# EAGLE design ThingPlus_Micromod (EAGLE 9.6.2)
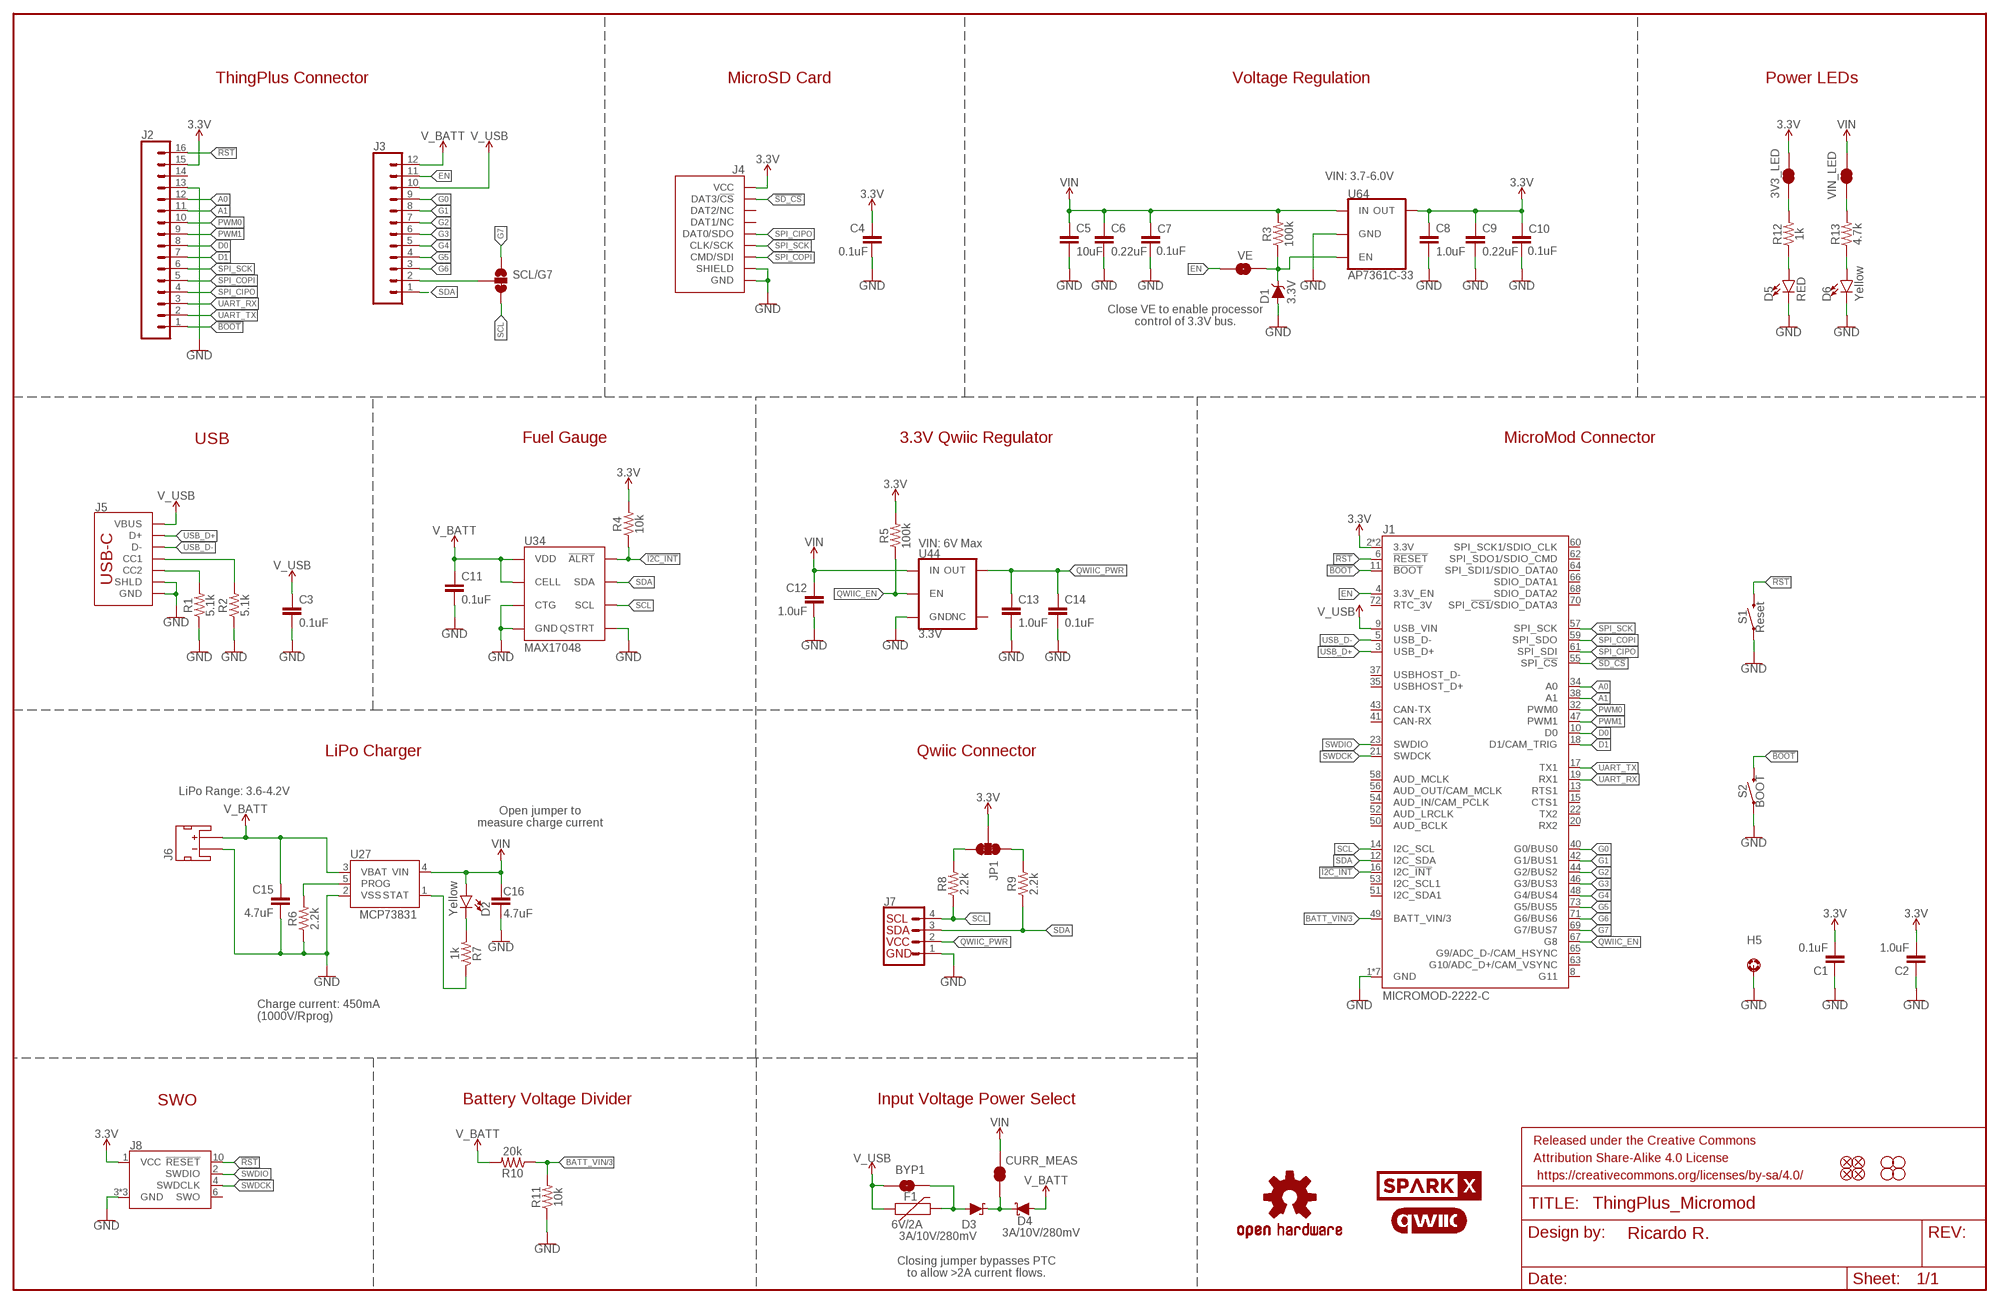
[diagram p0: schematic, sheet 1]

## Parts
3V3_LED  JUMPER-SMT_2_NC_TRACE_SILK  [SMT-JUMPER_2_NC_TRACE_SILK]
BYP1  JUMPER-SMT_2_NO_SILK  [SMT-JUMPER_2_NO_SILK]
C1  0.1uF  0.1UF-0603-25V-(+80/-20%)  [0603]
C2  1.0uF  1.0UF-0603-16V-10%  [0603]
C3  0.1uF  0.1UF-0603-25V-(+80/-20%)  [0603]
C4  0.1uF  0.1UF-0603-25V-(+80/-20%)  [0603]
C5  10uF  10UF-0805-25V-10%  [0805]
C6  0.22uF  0.22UF-0603-25V-10%  [0603]
C7  0.1uF  0.1UF-0603-25V-(+80/-20%)  [0603]
C8  1.0uF  1.0UF-0603-16V-10%  [0603]
C9  0.22uF  0.22UF-0603-25V-10%  [0603]
C10  0.1uF  0.1UF-0603-25V-(+80/-20%)  [0603]
C11  0.1uF  0.1UF-0603-25V-(+80/-20%)  [0603]
C12  1.0uF  1.0UF-0603-16V-10%  [0603]
C13  1.0uF  1.0UF-0603-16V-10%  [0603]
C14  0.1uF  0.1UF-0603-25V-(+80/-20%)  [0603]
C15  4.7uF  4.7UF-0603-6.3V-(10%)  [0603]
C16  4.7uF  4.7UF-0603-35V-(20%)  [0603]
CURR_MEAS  JUMPER-COMBO_2_NC_TRACE  [COMBO-JUMPER_2_NC_TRACE]
D1  3.3V  DIODE-ZENER-MM3Z3V3T1G  [SOD-323]
D2  Yellow  LED-YELLOW0603  [LED-0603]
D3  3A/10V/280mV  DIODE-SCHOTTKY-BAT60A  [SOD-323]
D4  3A/10V/280mV  DIODE-SCHOTTKY-BAT60A  [SOD-323]
D5  RED  LED-RED0603  [LED-0603]
D6  Yellow  LED-YELLOW0603  [LED-0603]
F1  6V/2A  PPTC_6V2A  [1210]
FD1  FIDUCIALUFIDUCIAL  [FIDUCIAL-MICRO]
FD2  FIDUCIALUFIDUCIAL  [FIDUCIAL-MICRO]
FD3  FIDUCIALUFIDUCIAL  [FIDUCIAL-MICRO]
FD4  FIDUCIALUFIDUCIAL  [FIDUCIAL-MICRO]
FRAME1  FRAME-LEDGER  [CREATIVE_COMMONS]
H1  STAND-OFF  [STAND-OFF]
H2  STAND-OFF  [STAND-OFF]
H3  STAND-OFF  [STAND-OFF]
H4  STAND-OFF  [STAND-OFF]
H5  STAND-OFF-REFLOW2.5MM_TALL  [STAND-OFF-REFLOW-M2.5]
J1  MICROMOD-2222-C  [M.2-CONNECTOR-E]
J2  CONN_161X16_SM_SQ_NOSILK  [1X16_SM_SQ_NOSILK]
J3  CONN_12SM_SQ_NO_SILK  [1X12_SM_SQ_NOSILK]
J4  MICRO-SD-SDIOPUSH-PUSH  [MICRO-SD-SOCKET]
J5  USB_C_4-LAYER_PADS  [USB-C-16P_4LAYER-PADS]
J6  JST_2MM_MALE  [JST-2-SMD]
J7  QWIIC_RIGHT_ANGLE  QWIIC_CONNECTORJS-1MM  [JST04_1MM_RA]
J8  JTAG  CORTEX_JTAG_DEBUG_MINIMUM_PTH  [2X5-PTH-1.27MM]
JP1  JUMPER-SMT_3_2-NC_TRACE_SILK  [SMT-JUMPER_3_2-NC_TRACE_SILK]
LOGO1  OSHW-LOGOMINI  [OSHW-LOGO-MINI]
LOGO2  QWIIC_LOGO_4MM  [QWIIC_4MM]
LOGO3  QWIIC_LOGO_4MM  [QWIIC_4MM]
R1  5.1k  5.1KOHM5.1KOHM-0603-1/10W-1%  [0603]
R2  5.1k  5.1KOHM5.1KOHM-0603-1/10W-1%  [0603]
R3  100k  100KOHM-0603-1/10W-1%  [0603]
R4  10k  10KOHM-0603-1/10W-1%  [0603]
R5  100k  100KOHM-0603-1/10W-1%  [0603]
R6  2.2k  2.2KOHM-0603-1/10W-1%  [0603]
R7  1k  1KOHM-0603-1/10W-1%  [0603]
R8  2.2k  2.2KOHM-0603-1/10W-1%  [0603]
R9  2.2k  2.2KOHM-0603-1/10W-1%  [0603]
R10  20k  20KOHM-0603-1/10W-1%  [0603]
R11  10k  10KOHM-0603-1/10W-1%  [0603]
R12  1k  1KOHM-0603-1/10W-1%  [0603]
R13  4.7k  4.7KOHM-0603-1/10W-1%  [0603]
S1  Reset  MOMENTARY-SWITCH-SPST-SMD-5.2-TALL-REDUNDANT  [TACTILE_SWITCH_SMD_5.2MM]
S2  BOOT  MOMENTARY-SWITCH-SPST-SMD-5.2-TALL-REDUNDANT  [TACTILE_SWITCH_SMD_5.2MM]
SCL/G7  JUMPER-SMT_3_1-NC_TRACE_SILK  [SMT-JUMPER_3_1-NC_TRACE_SILK]
U27  MCP73831  [SOT23-5]
U34  MAX17048  MAX17048DFN8  [DFN-8]
U44  3.3V  V_REG_AP2112K-3.3V  [SOT23-5]
U64  AP7361C-33  AP7361C-33FGEUDFN-8  [UDFN-8]
U$1  SPARKX-LOGO5  [SPARKX-LARGE]
U$2  SPARKX-LOGO5  [SPARKX-LARGE]
VE  JUMPER-SMT_2_NO_SILK  [SMT-JUMPER_2_NO_SILK]
VIN_LED  JUMPER-SMT_2_NC_TRACE_SILK  [SMT-JUMPER_2_NC_TRACE_SILK]

## Nets
3.3V: 3V3_LED.2 C1.2 C2.2 C4.1 C8.1 C9.1 C10.1 J1.2(3.3V) J1.74(3.3V) J2.15 J4.VCC J8.1(VCC) JP1.2 R4.2 R5.2 U64.1(OUT)
3.3V_EN_VE: D1.C R3.1 U64.5(EN) VE.2
!BOOT!: J1.11(!BOOT!) J2.1 S2.3 S2.4
!I2C_INT!: J1.16(I2C_!INT!) R4.1 U34.5(!ALRT)
!RST!: J1.6(!RESET!) J2.16 J8.10(!RESET) S1.3 S1.4
!SD_CS!: J1.55(SPI_!CS!) J4.CS/DAT3(DAT3/!CS!)
A0: J1.34(A0) J2.12
A1: J1.38(A1) J2.11
BATT_VIN/3: J1.49(BATT_VIN/3) R10.1 R11.2
CHG_LED: R7.1 U27.1(STAT)
D0: J1.10(D0) J2.8
D1: J1.18(D1/CAM_TRIG) J2.7
EN: J1.4(3.3V_EN) J3.11 VE.1
G0: J1.40(G0/BUS0) J3.9
G1: J1.42(G1/BUS1) J3.8
G2: J1.44(G2/BUS2) J3.7
G3: J1.46(G3/BUS3) J3.6
G4: J1.48(G4/BUS4) J3.5
G5: J1.73(G5/BUS5) J3.4
G6: J1.71(G6/BUS6) J3.3
G7: J1.69(G7/BUS7) SCL/G7.1
GND: C1.1 C2.1 C3.2 C4.2 C5.2 C6.2 C7.2 C8.2 C9.2 C10.2 C11.2 C12.2 C13.2 C14.2 C15.2 C16.2 D1.A D5.C D6.C H5.1 J1.1(GND) J1.7(GND) J1.33(GND) J1.36(GND) J1.39(GND) J1.45(GND) J1.75(GND) J2.13 J4.CD1(SHIELD) J4.GND J4.GND1(GND) J4.GND3(GND) J5.GND J5.GND2(GND) J5.SHLD1(SHLD) J5.SHLD2(SHLD) J5.SHLD3(SHLD) J5.SHLD4(SHLD) J6.1(-) J7.1 J8.3(GND) J8.5(GND) J8.9(GND) R1.1 R2.1 R6.1 R11.1 S1.1 S1.2 S2.1 S2.2 U27.2(VSS) U34.1(CTG) U34.4(GND) U34.6(QSTRT) U34.9(GND) U44.2(GND) U64.4(GND) U64.EP(GND)
N$2: JP1.3 R8.2
N$3: JP1.1 R9.2
N$4: BYP1.2 D3.A F1.2
N$5: CURR_MEAS.1 CURR_MEAS.3 D3.C D4.C
N$6: 3V3_LED.1 R12.2
N$8: R6.2 U27.5(PROG)
N$9: D5.A R12.1
N$10: R13.2 VIN_LED.1
N$11: D6.A R13.1
N$12: J5.A5(CC1) R2.2
N$13: J5.B5(CC2) R1.2
N$14: D2.C R7.2
PWM0: J1.32(PWM0) J2.10
PWM1: J1.47(PWM1) J2.9
QWIIC_EN: J1.67(G8) R5.1 U44.3(EN)
QWIIC_PWR: C13.1 C14.1 J7.2 U44.5(OUT)
SCL: J1.14(I2C_SCL) J7.4 R8.1 SCL/G7.3 U34.7(SCL)
SCL/G7: J3.2 SCL/G7.2
SDA: J1.12(I2C_SDA) J3.1 J7.3 R9.1 U34.8(SDA)
SPI_CIPO: J1.61(SPI_SDI) J2.4 J4.DO/DAT0(DAT0/SDO)
SPI_COPI: J1.59(SPI_SDO) J2.5 J4.DI/CMD(CMD/SDI)
SPI_SCK: J1.57(SPI_SCK) J2.6 J4.SCLK(CLK/SCK)
SWDCK: J1.21(SWDCK) J8.4(SWDCLK)
SWDIO: J1.23(SWDIO) J8.2(SWDIO)
UART_RX: J1.19(RX1) J2.3
UART_TX: J1.17(TX1) J2.2
USB_D+: J1.3(USB_D+) J5.A6(D+) J5.B6(D+)
USB_D-: J1.5(USB_D-) J5.A7(D-) J5.B7(D-)
V_BATT: C11.1 C15.1 D4.A J3.12 J6.2(+) R10.2 U27.3(VBAT) U34.2(CELL) U34.3(VDD)
V_USB: BYP1.1 C3.1 F1.1 J1.9(USB_VIN) J3.10 J5.VBUS1(VBUS) J5.VBUS2(VBUS)
VIN: C5.1 C6.1 C7.1 C12.1 C16.1 CURR_MEAS.2 CURR_MEAS.4 D2.A R3.2 U27.4(VIN) U44.1(IN) U64.8(IN) VIN_LED.2
Unconnected: J1.8(G11) J1.13(RTS1) J1.15(CTS1) J1.20(RX2) J1.22(TX2) J1.35(USBHOST_D+) J1.37(USBHOST_D-) J1.41(CAN-RX) J1.43(CAN-TX) J1.50(AUD_BCLK) J1.51(I2C_SDA1) J1.52(AUD_LRCLK) J1.53(I2C_SCL1) J1.54(AUD_IN/CAM_PCLK) J1.56(AUD_OUT/CAM_MCLK) J1.58(AUD_MCLK) J1.60(SPI_SCK1/SDIO_CLK) J1.62(SPI_SDO1/SDIO_CMD) J1.63(G10/ADC_D+/CAM_VSYNC) J1.64(SPI_SDI1/SDIO_DATA0) J1.65(G9/ADC_D-/CAM_HSYNC) J1.66(SDIO_DATA1) J1.68(SDIO_DATA2) J1.70(SPI_!CS1!/SDIO_DATA3) J1.72(RTC_3V) J2.14 J4.DAT1(DAT1/NC) J4.DAT2(DAT2/NC) J6.NC1(PAD1) J6.NC2(PAD2) J8.6(SWO) U44.4(NC)

## Notes on the sheet
- ThingPlus Connector | MicroSD Card | Voltage Regulation | Power LEDs
- VIN: 3.7-6.0V
- Close VE to enable processor
  control of 3.3V bus.
- USB | Fuel Gauge | 3.3V Qwiic Regulator | MicroMod Connector
- VIN: 6V Max
- LiPo Charger | Qwiic Connector
- LiPo Range: 3.6-4.2V
- Open jumper to
  measure charge current
- Charge current: 450mA
  (1000V/Rprog)
- SWO | Battery Voltage Divider | Input Voltage Power Select
- Closing jumper bypasses PTC
  to allow >2A current flows.

## Library data of the parts
3V3_LED VIN_LED = SparkFun-Jumpers:JUMPER-SMT_2_NC_TRACE: Normally closed trace jumper This jumper has a trace between two pads so it's normally closed (NC). Use a razor knife to open the connection. For best results follow the IPC guidelines for cutting traces: Cutout at least 0.063 mm (0.005 in). Remove all loose material to clean up the cut area. Seal the cut with an approved epoxy. Reapply solder to reclose the connection.
BYP1 VE = SparkFun-Jumpers:JUMPER-SMT_2_NO: Normally open jumper This jumper has two pads in close proximity to each other. Apply solder to close the connection. Round pads are easier to solder for beginners, but are a lot larger. SparkFun Product that uses the round pads: SparkFun EL Sequencer <https://www.sparkfun.com/products/12781>
C1 C3 C4 C7 C10 C11 C14 = SparkFun-Capacitors:0.1UF: 0.1µF ceramic capacitors A capacitor is a passive two-terminal electrical component used to store electrical energy temporarily in an electric field.; PROD_ID: CAP-00810
C2 C8 C12 C13 = SparkFun-Capacitors:1.0UF: 1µF ceramic capacitors A capacitor is a passive two-terminal electrical component used to store electrical energy temporarily in an electric field.; PROD_ID: CAP-00868
C5 = SparkFun-Capacitors:10UF: 10.0µF ceramic capacitors A capacitor is a passive two-terminal electrical component used to store electrical energy temporarily in an electric field.; PROD_ID: CAP-14259
C6 C9 = SparkFun-Capacitors:0.22UF: 0.22µF ceramic capacitors A capacitor is a passive two-terminal electrical component used to store electrical energy temporarily in an electric field.; PROD_ID: CAP-07822
C15 = SparkFun-Capacitors:4.7UF: 4.7µF ceramic capacitors A capacitor is a passive two-terminal electrical component used to store electrical energy temporarily in an electric field.; PROD_ID: CAP-08280
C16 = SparkFun-Capacitors:4.7UF: 4.7µF ceramic capacitors A capacitor is a passive two-terminal electrical component used to store electrical energy temporarily in an electric field.; PROD_ID: CAP-14106
CURR_MEAS = SparkFun-Jumpers:JUMPER-COMBO_2_NC_TRACE
D1 = SparkFun-DiscreteSemi:DIODE-ZENER: Zener Diode A Zener diode allows current to flow from its anode to its cathode like a normal semiconductor diode, but it also permits current to flow in the reverse direction when its "Zener voltage" is reached. - WIkipedia; PROD_ID: DIO-11284
D2 D6 = SparkFun-LED:LED-YELLOW: Yellow SMD LED Used in manufacturing several products at SparkFun. Packages: 0603 - SMD 0603 package[Product Link] <http://www.kingbrightusa.com/product.asp?catalog_name=LED&product_id=APT1608SYCK> 0603 -SMART - SMART SMD 0603 package (more efficient/more expensive) [Product Link] <http://www.osram-os.com/osram_os/en/products/product-catalog/led-light-emitting-diodes/smartled-0603/ly-l29k/index.jsp> LilyPad - SMD1206 package[Product Datasheet] <https://www.sparkfun.com/datasheets/DevTools/LilyPad/Q150YUS4.pdf> SparkFun Products: Blynk Board <https://www.sparkfun.com/products/13794> IOIO-OTG <https://www.sparkfun.com/products/13613> XBee Explorer Serial <https://www.sparkfun.com/products/13225>; PROD_ID: DIO-09003
D3 D4 = SparkFun-DiscreteSemi:DIODE-SCHOTTKY: Schottky diode A Schottky diode is a semiconductor diode which has a low forward voltage drop and a very fast switching action.; PROD_ID: DIO-14072
D5 = SparkFun-LED:LED-RED: Red SMD LED Used in manufacturing of most products at SparkFun Packages: 0603 - SMD 0603 package [Product Link] <http://docs.avagotech.com/docs/AV02-0551EN> 0603 SMART - SMD 0603 SMART package ( more efficient and expensive)[Product Link] <http://www.osram-os.com/Graphics/XPic2/00077099_0.pdf> 1206 - SMD1206 package [Product Link] <https://www.sparkfun.com/datasheets/DevTools/LilyPad/Q150OVS4.pdff> SparkFun Products: Pro Mini 328 -5V <https://www.sparkfun.com/products/821> RedBoard <https://www.sparkfun.com/products/12757> IOIO-OTG <https://www.sparkfun.com/products/13613>; PROD_ID: DIO-00819
F1 = SparkFun-Fuses:PPTC: Resettable Fuse PPTC Resettable Fuse. Really a sort of resistor with a polymeric positive temperature coefficient whose resistance increases dramatically with an increase in temperature. When heated by the power passing through the resistance rises causing the current to be limited, protecting the circuit. This is achieved by the transition of the polymer from a crystalline to an amorphous state where the conductive carbon separates breaking the conductive pathways found in the cool crystalline structure. When a PPTC cools back down it resumes conducting letting the circuit turn back on. SparkFun Products: SparkFun RedBoard - Programmed with Arduino <https://www.sparkfun.com/products/12757> Pro Micro - 5V/16MHz <https://www.sparkfun.com/products/12640> Arduino Pro 328 - 5V/16MHz <https://www.sparkfun.com/products/10915> MP3 Trigger <https://www.sparkfun.com/products/13720>; PROD_ID: RES-14313
FD1-FD4 = SparkFun-Aesthetics:FIDUCIAL: Fiducial Alignment Points Point-of-reference for pick-and-place machines and other optical instruments.
FRAME1 = SparkFun-Aesthetics:FRAME-LEDGER: Schematic Frame - Ledger Standard 11x14 US Ledger frame; DESIGNER: Ricardo R.
H1-H4 = SparkFun-Hardware:STAND-OFF: Stand Off Drill holes for mechanically mounting via screws, standoffs, etc. Note: Use the keepout ring to avoid running the screw head into surrounding components. Variant Overviews STAND-OFF - Mechanical footprint for a #4 phillips button head screw. STAND-OFF-TIGHT - Mechanical footprint for a #4 phillips button head screw, Example SparkFun Products Screw - Phillips Head (1/4", 4-40, 10 pack) <https://www.sparkfun.com/products/10453> (PRT-10453) Screw - Phillips Head (1/2", 4-40, 10 pack) <https://www.sparkfun.com/products/10452> (PRT-10452) Screw - Phillips Head (3/4", 4-40, 10 pack) <https://www.sparkfun.com/products/10451> (PRT-10451) Screw - Phillips Head (1", 4-40, 10 pack) <https://www.sparkfun.com/products/10450> (PRT-10450)
H5 = SparkFun-Hardware:STAND-OFF-REFLOW: Stand Off Reflow Compatible A metal standoff that can be placed and reflowed onto a PCB.; PROD_ID: HW-14899
J1 = SparkFun-MicroMod:MICROMOD: MicroMod Connector Description: A card edge connector and mating PCB connector to allow various MicroMod Processor Boards to be coupled with various carrier boards of different capabilities. Based on the M.2 standard.; PROD_ID: CONN-14877
J2 = SparkFun-Connectors:CONN_16: Multi connection point. Often used as Generic Header-pin footprint for 0.1 inch spaced/style header connections On any of the 0.1 inch spaced packages, you can populate with these: Break Away Headers - Straight <https://www.sparkfun.com/products/116> (PRT-00116) Break Away Male Headers - Right Angle <https://www.sparkfun.com/products/553> (PRT-00553) Female Headers <https://www.sparkfun.com/products/115> (PRT-00115) Break Away Headers - Machine Pin <https://www.sparkfun.com/products/117> (PRT-00117) Break Away Female Headers - Swiss Machine Pin <https://www.sparkfun.com/products/743> (PRT-00743) For SCREWTERMINALS and SPRING TERMINALS visit here: Screw Terimnals on SparkFun.com <https://www.sparkfun.com/search/results?term=Screw+Terminals> (5mm/3.5mm/2.54mm spacing) This device is also useful as a general connection point to wire up your design to another part of your project. Our various solder wires solder well into these plated through hole pads. Hook-Up Wire - Assortment (Stranded, 22 AWG) <https://www.sparkfun.com/products/11375> (PRT-11375) Hook-Up Wire - Assortment (Solid Core, 22 AWG) <https://www.sparkfun.com/products/11367> (PRT-11367) View the entire wire category on our website here <https://www.sparkfun.com/categories/141> Special notes: Molex polarized connector foot print use with SKU : PRT-08231 with associated crimp pins and housings. 1MM SMD Version SKU: PRT-10208 NOTES ON THE VARIANTS LOCK and LOCK_LONGPADS... This footprint was designed to help hold the alignment of a through-hole component (i.e. 6-pin header) while soldering it into place. You may notice that each hole has been shifted either up or down by 0.005 of an inch from it's more standard position (which is a perfectly straight line). This slight alteration caused the pins (the squares in the middle) to touch the edges of the holes. Because they are alternating, it causes a "brace" to hold the component in place. 0.005 has proven to be the perfect amount of "off-center" position when using our standard breakaway headers. Although looks a little odd when you look at the bare footprint, once you have a header in there, the alteration is very hard to notice. Also,if you push a header all the way into place, it is covered up entirely on the bottom side.
J3 = SparkFun-Connectors:CONN_12: Multi connection point. Often used as Generic Header-pin footprint for 0.1 inch spaced/style header connections On any of the 0.1 inch spaced packages, you can populate with these: Break Away Headers - Straight <https://www.sparkfun.com/products/116> (PRT-00116) Break Away Male Headers - Right Angle <https://www.sparkfun.com/products/553> (PRT-00553) Female Headers <https://www.sparkfun.com/products/115> (PRT-00115) Break Away Headers - Machine Pin <https://www.sparkfun.com/products/117> (PRT-00117) Break Away Female Headers - Swiss Machine Pin <https://www.sparkfun.com/products/743> (PRT-00743) For SCREWTERMINALS and SPRING TERMINALS visit here: Screw Terimnals on SparkFun.com <https://www.sparkfun.com/search/results?term=Screw+Terminals> (5mm/3.5mm/2.54mm spacing) This device is also useful as a general connection point to wire up your design to another part of your project. Our various solder wires solder well into these plated through hole pads. Hook-Up Wire - Assortment (Stranded, 22 AWG) <https://www.sparkfun.com/products/11375> (PRT-11375) Hook-Up Wire - Assortment (Solid Core, 22 AWG) <https://www.sparkfun.com/products/11367> (PRT-11367) View the entire wire category on our website here <https://www.sparkfun.com/categories/141> Special notes: Molex polarized connector foot print use with SKU : PRT-08231 with associated crimp pins and housings. 1MM SMD Version SKU: PRT-10208 NOTES ON THE VARIANTS LOCK and LOCK_LONGPADS... This footprint was designed to help hold the alignment of a through-hole component (i.e. 6-pin header) while soldering it into place. You may notice that each hole has been shifted either up or down by 0.005 of an inch from it's more standard position (which is a perfectly straight line). This slight alteration caused the pins (the squares in the middle) to touch the edges of the holes. Because they are alternating, it causes a "brace" to hold the component in place. 0.005 has proven to be the perfect amount of "off-center" position when using our standard breakaway headers. Although looks a little odd when you look at the bare footprint, once you have a header in there, the alteration is very hard to notice. Also,if you push a header all the way into place, it is covered up entirely on the bottom side.
J4 = SparkFun-Connectors:MICRO-SD-SDIO: microSD Socket for Transflash Push-push type µSD socket. tDoc lines correctly indicate media card edge positions when inserting (unlocked, locked, depressed). NOTE: CD1 and CD2 are connected internally, and the default detect state of the socket is detect pin to ground. SparkFun Products: WAV Trigger <https://www.sparkfun.com/products/13660> CAN-Bus Shield <https://www.sparkfun.com/products/13262> SparkFun Level Shifing microSD Breakout <https://www.sparkfun.com/products/13743>; PROD_ID: CONN-07820
J5 = SparkFun-Connectors:USB_C: USB Type C 16Pin Connector Super Speed pins not available on the 16-pin purely SMD connector so this part is best for USB 2.0 implementations. D1 and D2 are tied together enabling D+/- no matter which way the cable is plugged into the connector. The two channel configuration pins (CC1/2) are exposed. These are normally connected to ground via 5.1k resistors but can be reconfigured for high current/high power applications. **4-LAYER BOARD WARNING!!** If designing 4-layer board, make sure to select the variant _4-LAYER-ISOLATED. The linked footprint (USB-C-16-4LAYER-ISOLATED) includes some very necessary cutout polygons in the inner layers (2 and 15). This prevents the PTH mounting shield legs on the USB connector from electrically connecting any other polygons on the inner layers (usually VCC and GND).; PROD_ID: CONN-14122
J6 = SparkFun-Connectors:JST_2MM_MALE: JST 2MM MALE RA CONNECTOR Two pin, compact surface mount connector. Commonly used as a battery input connection point. We really like the solid locking feeling and high current rating on these small connectors. We use these all the time as battery connectors. Mates to single-cell LiPo batteries. Here is the connector we sell at SparkFun: JST Right Angle Connector - White <https://www.sparkfun.com/products/8612> (PRT-08612) Datasheet <http://www.sparkfun.com/datasheets/Prototyping/Connectors/JST-Horizontal.pdf> It was used on these SparkFun products: SparkFun MOSFET Power Controller <https://www.sparkfun.com/products/11214> (PRT-11214) SparkFun Battery Babysitter - LiPo Battery Manager <https://www.sparkfun.com/products/13777> (PRT-13777) And many, many others that required a lipo battery connection.; PROD_ID: CONN-11443; SF_ID: PRT-08612
J7 = SparkFun-Connectors:QWIIC_CONNECTOR: SparkFun I2C Standard Qwiic Connector An SMD 1mm pitch JST connector makes it easy and quick (get it? Qwiic?) to connect I2C devices to each other. The Qwiic system <http://www.sparkfun.com/qwiic> enables fast and solderless connection between popular platforms and various sensors and actuators. We carry 200mm <https://www.sparkfun.com/products/14204>, 100mm <https://www.sparkfun.com/products/14205>, 50mm <https://www.sparkfun.com/products/14206>, and breadboard friendly <https://www.sparkfun.com/products/14207> Qwiic cables. We also offer 10 pcs strips <https://www.sparkfun.com/products/14323> the SMD connectors.; PROD_ID: CONN-13694
J8 = SparkFun-Connectors:CORTEX_JTAG_DEBUG_MINIMUM: Cortex Debug Connector - 10 pin Supports JTAG debug, Serial Wire debug, and Serial Wire Viewer. PTH and SMD connector options available. General Connector Information <http://infocenter.arm.com/help/topic/com.arm.doc.faqs/attached/13634/cortex_debug_connectors.pdf> Products: PTH Connector <http://www.digikey.com/product-detail/en/cnc-tech/3220-10-0100-00/1175-1627-ND/3883661> -via Digi-Key SparkFun PSoc <https://www.sparkfun.com/products/13229> SparkFun T <https://www.sparkfun.com/products/13810>
JP1 = SparkFun-Jumpers:JUMPER-SMT_3_2-NC_TRACE: Normally closed trace jumper (2 of 2 connections) This jumper has a trace between all three pads so they are normally closed (NC). Use a razor knife to open the connection(s). For best results follow the IPC guidelines for cutting traces: Cutout at least 0.063 mm (0.005 in). Remove all loose material to clean up the cut area. Seal the cut with an approved epoxy. Reapply solder to reclose the connection(s).
LOGO1 = SparkFun-Aesthetics:OSHW-LOGO: Open-Source Hardware (OSHW) Logo This logo indicates the piece of hardware it is found on incorporates a OSHW license and/or adheres to the definition of open source hardware found here: http://freedomdefined.org/OSHW
LOGO2 LOGO3 = SparkFun-Aesthetics:QWIIC_LOGO: Qwiic Logos for placement on schematic and PCB. The 5.5mm silk logo is best for placing next to Qwiic connector.
R1 R2 = SparkFun-Resistors:5.1KOHM; PROD_ID: RES-12083
R3 R5 = SparkFun-Resistors:100KOHM: 100kΩ resistor A resistor is a passive two-terminal electrical component that implements electrical resistance as a circuit element. Resistors act to reduce current flow, and, at the same time, act to lower voltage levels within circuits. - Wikipedia; PROD_ID: RES-07828
R4 R11 = SparkFun-Resistors:10KOHM: 10kΩ resistor A resistor is a passive two-terminal electrical component that implements electrical resistance as a circuit element. Resistors act to reduce current flow, and, at the same time, act to lower voltage levels within circuits. - Wikipedia; PROD_ID: RES-00824
R6 R8 R9 = SparkFun-Resistors:2.2KOHM: 2.2kΩ resistor A resistor is a passive two-terminal electrical component that implements electrical resistance as a circuit element. Resistors act to reduce current flow, and, at the same time, act to lower voltage levels within circuits. - Wikipedia; PROD_ID: RES-08272
R7 R12 = SparkFun-Resistors:1KOHM: 1kΩ resistor A resistor is a passive two-terminal electrical component that implements electrical resistance as a circuit element. Resistors act to reduce current flow, and, at the same time, act to lower voltage levels within circuits. - Wikipedia; PROD_ID: RES-07856
R10 = SparkFun-Resistors:20KOHM: 20kΩ resistor A resistor is a passive two-terminal electrical component that implements electrical resistance as a circuit element. Resistors act to reduce current flow, and, at the same time, act to lower voltage levels within circuits. - Wikipedia; PROD_ID: RES-09383
R13 = SparkFun-Resistors:4.7KOHM: 4.7kΩ resistor A resistor is a passive two-terminal electrical component that implements electrical resistance as a circuit element. Resistors act to reduce current flow, and, at the same time, act to lower voltage levels within circuits. - Wikipedia; PROD_ID: RES-07857
S1 S2 = SparkFun-Switches:MOMENTARY-SWITCH-SPST: Momentary Switch (Pushbutton) - SPST Normally-open (NO) SPST momentary switches (buttons, pushbuttons). Variants PTH-12MM - 12mm square, through-hole Momentary Pushbutton Switch - 12mm Square <https://www.sparkfun.com/products/9190> (COM-09190) PTH-6.0MM, PTH-6.0MM-KIT - 6.0mm square, through-hole Mini Pushbutton Switch <https://www.sparkfun.com/products/97> (COM-00097) KIT package intended for soldering kit's - only one side of pads' copper is exposed. PTH-RIGHT-ANGLE-KIT - Right-angle, through-hole Right Angle Tactile Button <https://www.sparkfun.com/products/10791> - Used on SparkFun BigTime Watch Kit <https://www.sparkfun.com/products/11734> SMD-12MM - 12mm square, surface-mount Tactile Button - SMD (12mm) <https://www.sparkfun.com/products/12993> (COM-12993) Used on SparkFun PicoBoard <https://www.sparkfun.com/products/11888> SMD-4.5MM - 4.5mm Square Trackball Switch Used on SparkFun Blackberry Trackballer Breakout <https://www.sparkfun.com/products/13169> SMD-4.6MMX2.8MM - 4.60mm x 2.80mm, surface mount Used on SparkFun SAMD21 Mini Breakout <https://www.sparkfun.com/products/13664> SMD-5.2MM, SMD-5.2-REDUNDANT - 5.2mm square, surface-mount Mini Pushbutton Switch - SMD <https://www.sparkfun.com/products/8720> (COM-08720) Used on Arduino Pro Mini <https://www.sparkfun.com/products/11114> REDUNDANT package connects both switch circuits together SMD-6.0X3.5MM - 6.0 x 3.5mm, surface mount Momentary Reset Switch SMD <https://www.sparkfun.com/products/8229> (COM-08229) SMD-6.2MM-TALL - 6.2mm square, surface mount Tactile Button - SMD (6mm) <https://www.sparkfun.com/products/12992> Used on SparkFun Digital Sandbox <https://www.sparkfun.com/products/12651> SMD-RIGHT-ANGLE - Right-angle, surface mount Used on SparkFun Block for Intel® Edison - Arduino <https://www.sparkfun.com/products/13036>; PROD_ID: SWCH-14139
SCL/G7 = SparkFun-Jumpers:JUMPER-SMT_3_1-NC_TRACE: Normally closed trace jumper (1 of 2 connections) This jumper has a trace between two pads so it's normally closed (NC). The other connection is normally open (NO). Use a razor knife to open the connection. For best results follow the IPC guidelines for cutting traces: Cutout at least 0.063 mm (0.005 in). Remove all loose material to clean up the cut area. Seal the cut with an approved epoxy. Reapply solder to reclose the connection, or to close the NO connection.
U27 = SparkFun-IC-Power:MCP73831: MCP73831T Li-Ion, Li-Pol Controller Miniature single cell, fully integrated Li-Ion, Li-polymer charge management controller Datasheet <http://ww1.microchip.com/downloads/en/DeviceDoc/20001984g.pdf> SparkFun Products: SparkFun ESP32 Thing <https://www.sparkfun.com/products/13907> SparkFun 9DoF Razor IMU M0 <https://www.sparkfun.com/products/14001>; PROD_ID: IC-09995
U34 = SparkFun-IC-Power:MAX17048: Micropower 1-Cell Li+ ModelGauge SparkFun Products Qduino Mini <https://www.sparkfun.com/products/13614> (DEV-13614); PROD_ID: IC-12551
U44 = SparkFun-IC-Power:V_REG_AP2112: AP2112 - 600mA CMOS LDO Regulator w/ Enable The AP2112 is CMOS process low dropout linear regulator with enable function, the regulator delivers a guaranteed 600mA (min.) continuous load current. Features Output Voltage Accuracy: ±1.5% Output Current: 600mA (Min.) Foldback Short Current Protection: 50mA Enable Function to Turn ON/OFF VOUT Low Dropout Voltage (3.3V): 250mV (Typ.) @IOUT=600mA Excellent Load Regulation: 0.2%/A (Typ.) Excellent Line Regulation: 0.02%/V (Typ.) Low Quiescent Current: 55μA (Typ.) Low Standby Current: 0.01μA (Typ.) Low Output Noise: 50μVRMS PSRR: 100Hz -65dB, 1kHz -65dB OTSD Protection Stable with 1.0μF Flexible Cap: Ceramic, Tantalum and Aluminum Electrolytic Operation Temperature Range: -40°C to 85°C ESD: MM 400V, HBM 4000V; PROD_ID: VREG-12457
U64 = SparkFun-IC-Power:AP7361C-33FGE: AP7361C 3.3V LDO Regulator; PROD_ID: VREG-14094
U$1 U$2 = SparkX:SPARKX-LOGO

## Net classes
0 default: width 0 mm, drill 0 mm
1 power: width 0.457 mm

## Board
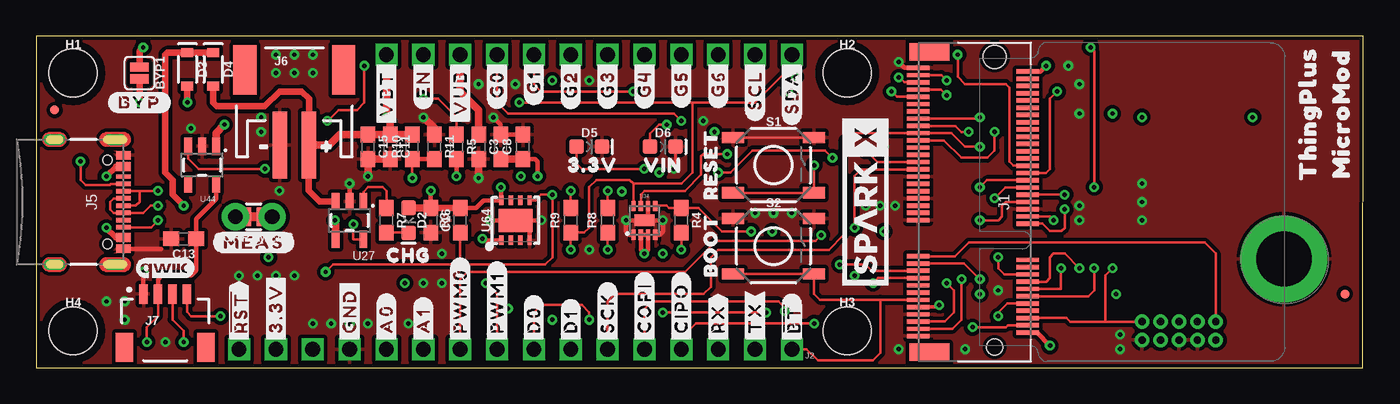
[diagram p1: board, top side]
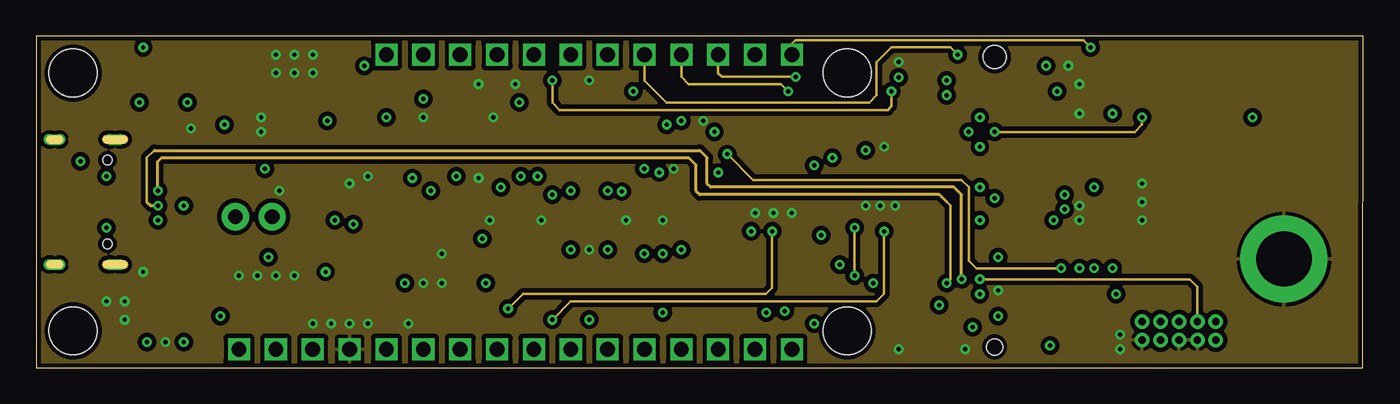
[diagram p2: board, inner layer Route2]
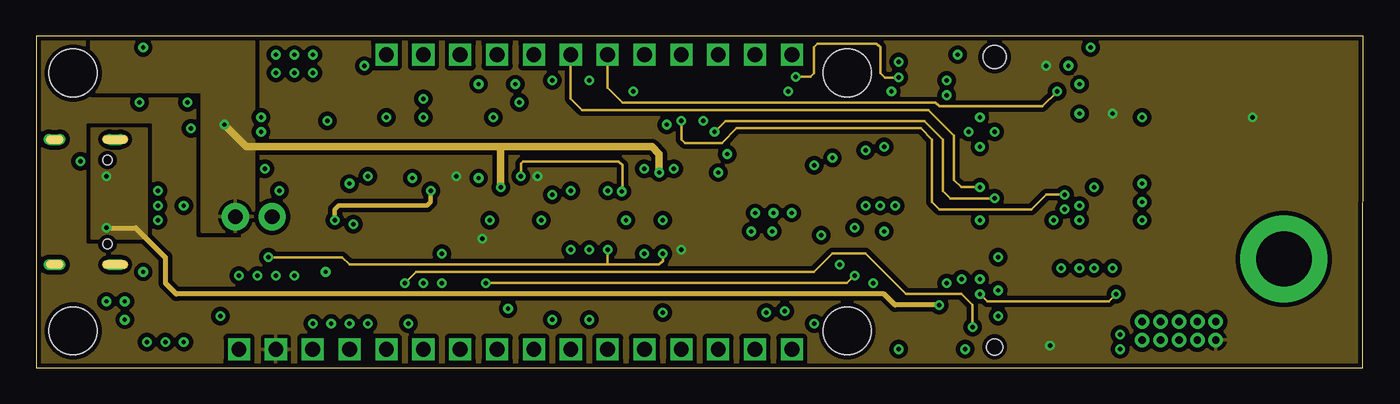
[diagram p3: board, inner layer Route15]
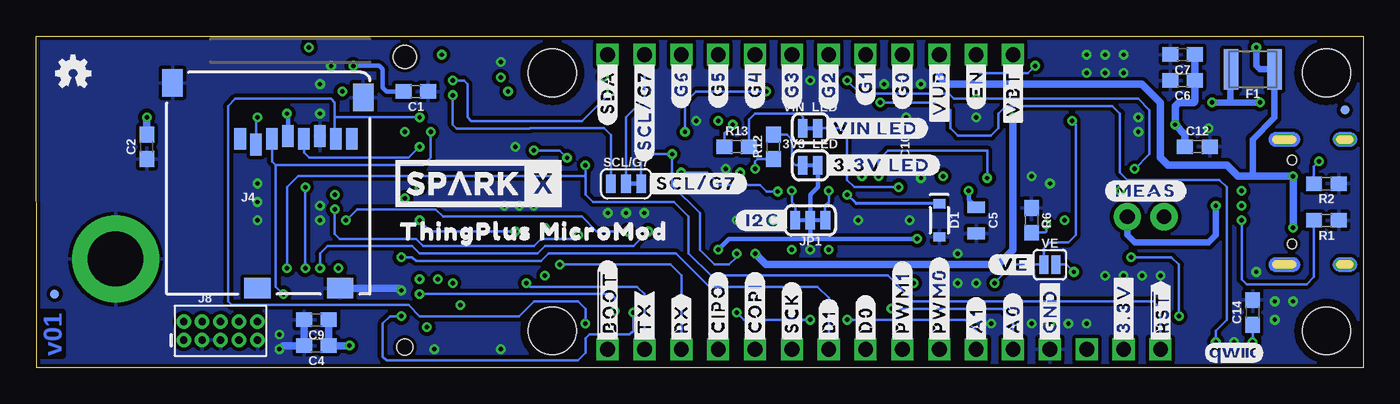
[diagram p4: board, bottom side, seen from below]

Size 91.44 x 22.86 mm. Coordinates in mm from the lower left corner, seen from the top.
Outline: 0,0 91.42,0 91.44,22.86 0,22.86 0,0
Copper layers (1+2*15+16): Top 0.035559375mm / dielectric 0.47751875mm / Route2 0.035559375mm / dielectric 0.47751875mm / Route15 0.035559375mm / dielectric 0.47751875mm / Bottom 0.035559375mm
Design rules "SparkFun-4-Layer-General-JLCPCB": minimum track width 7mil, minimum drill 12mil, track to track 7mil, track to pad 7mil, pad to pad 7mil, via to via 7mil, smd to smd 7mil, copper to edge 7mil, drill to drill 7mil, minimum pad ring 7mil, minimum via ring 7mil, stop-mask expansion 4mil, vias tented up to drill 25mil, thermal gap 10mil

### Footprints (pad centres in the part's own frame; a part is rotated, then mirrored left to right if it is on the bottom)
SMT-JUMPER_2_NC_TRACE_SILK = smd 0.66 x 1.27: 1 -0.521,0; 2 0.521,0
SMT-JUMPER_2_NO_SILK = smd 0.635 x 1.27: 1 -0.406,0; 2 0.406,0
0603 = smd 1.1 x 1: 1 -0.85,0; 2 0.85,0
0805 = smd 0.8 x 1.2: 1 -0.9,0; 2 0.9,0
COMBO-JUMPER_2_NC_TRACE = smd 0.635 x 1.27: 1 -0.508,0; 2 0.508,0 | drill 1.016 pad 1.88: 3 -1.27,0; 4 1.27,0
SOD-323 = smd 0.63 x 0.83: A 1.15,0; C -1.15,0
LED-0603 = smd 1 x 1: A -0.877,0; C 0.877,0
1210 = smd 1 x 2.8: 1 -1.5,0; 2 1.5,0
FIDUCIAL-MICRO = smd 0.635 x 0.635: 1 0,0
STAND-OFF = hole 3.302: 0,0
STAND-OFF-REFLOW-M2.5 = drill 3.8 pad 6: 1 0,0
M.2-CONNECTOR-E = smd 0.3 x 1.55: 1 9.25,-5.275; 2 9,2.275; 3 8.75,-5.275; 4 8.5,2.275; 5 8.25,-5.275; 6 8,2.275; 7 7.75,-5.275; 8 7.5,2.275; 9 7.25,-5.275; 10 7,2.275; 11 6.75,-5.275; 12 6.5,2.275; 13 6.25,-5.275; 14 6,2.275; 15 5.75,-5.275; 16 5.5,2.275; 17 5.25,-5.275; 18 5,2.275; 19 4.75,-5.275; 20 4.5,2.275; 21 4.25,-5.275; 22 4,2.275; 23 3.75,-5.275; 32 1.5,2.275; 33 1.25,-5.275; 34 1,2.275; 35 0.75,-5.275; 36 0.5,2.275; 37 0.25,-5.275; 38 0,2.275; 39 -0.25,-5.275; 40 -0.5,2.275; 41 -0.75,-5.275; 42 -1,2.275; 43 -1.25,-5.275; 44 -1.5,2.275; 45 -1.75,-5.275; 46 -2,2.275; 47 -2.25,-5.275; 48 -2.5,2.275; 49 -2.75,-5.275; 50 -3,2.275; 51 -3.25,-5.275; 52 -3.5,2.275; 53 -3.75,-5.275; 54 -4,2.275; 55 -4.25,-5.275; 56 -4.5,2.275; 57 -4.75,-5.275; 58 -5,2.275; 59 -5.25,-5.275; 60 -5.5,2.275; 61 -5.75,-5.275; 62 -6,2.275; 63 -6.25,-5.275; 64 -6.5,2.275; 65 -6.75,-5.275; 66 -7,2.275; 67 -7.25,-5.275; 68 -7.5,2.275; 69 -7.75,-5.275; 70 -8,2.275; 71 -8.25,-5.275; 72 -8.5,2.275; 73 -8.75,-5.275; 74 -9,2.275; 75 -9.25,-5.275 | smd 1.2 x 2.75: A1 10.35,-4.5; A2 -10.35,-4.5 | hole 1.1: 10,0 | hole 1.6: -10,0
1X16_SM_SQ_NOSILK = drill 1.016 pad 1.27 square: 1 0,0; 2 2.54,0; 3 5.08,0; 4 7.62,0; 5 10.16,0; 6 12.7,0; 7 15.24,0; 8 17.78,0; 9 20.32,0; 10 22.86,0; 11 25.4,0; 12 27.94,0; 13 30.48,0; 14 33.02,0; 15 35.56,0; 16 38.1,0
1X12_SM_SQ_NOSILK = drill 1.016 pad 1.27 square: 1 0,0; 2 2.54,0; 3 5.08,0; 4 7.62,0; 5 10.16,0; 6 12.7,0; 7 15.24,0; 8 17.78,0; 9 20.32,0; 10 22.86,0; 11 25.4,0; 12 27.94,0
MICRO-SD-SOCKET = smd 1.8 x 1.4: CD1 -2.05,0.4; CD2 -7.75,0.4 | smd 0.8 x 1.5: CS/DAT3 -7.84,10.3; DAT1 -1.24,10.7; DAT2 -8.94,10.7; DI/CMD -6.74,10.7; DO/DAT0 -2.34,10.7; GND -3.44,10.9; SCLK -4.54,10.7; VCC -5.64,10.9 | smd 1.4 x 1.9: GND1 -13.6,14.55; GND3 -0.45,13.55
USB-C-16P_4LAYER-PADS = smd 0.3 x 1: A5 -1.25,-0.34; A6 -0.25,-0.34; A7 0.25,-0.34; A8 1.25,-0.34; B5 1.75,-0.34; B6 0.75,-0.34; B7 -0.75,-0.34; B8 -1.75,-0.34 | smd 0.6 x 1: GND -3.225,-0.34; GND2 3.225,-0.34; VBUS1 -2.45,-0.34; VBUS2 2.45,-0.34 | drill 0.4 pad 0.6 long: SHLD1 -4.318,-0.915; SHLD2 4.318,-0.915; SHLD3 -4.318,-5.095; SHLD4 4.318,-5.095 | hole 0.65: -2.89,-1.445; 2.89,-1.445
JST-2-SMD = smd 1 x 4.6: 1 -1,-3.7; 2 1,-3.7 | smd 1.6 x 3.4: NC1 -3.4,1.5; NC2 3.4,1.5
JST04_1MM_RA = smd 0.6 x 1.35: 1 -1.5,0; 2 -0.5,0; 3 0.5,0; 4 1.5,0 | smd 1.2 x 2: NC1 2.8,-3.675; NC2 -2.8,-3.675
2X5-PTH-1.27MM = drill 0.508 pad 1: 1 -2.54,-0.635; 2 -2.54,0.635; 3 -1.27,-0.635; 4 -1.27,0.635; 5 0,-0.635; 6 0,0.635; 7 1.27,-0.635; 8 1.27,0.635; 9 2.54,-0.635; 10 2.54,0.635
SMT-JUMPER_3_2-NC_TRACE_SILK = smd 0.66 x 1.27: 1 -1.041,0; 2 0,0; 3 1.041,0
TACTILE_SWITCH_SMD_5.2MM = smd 1.524 x 0.762: 1 -2.794,1.905; 2 2.794,1.905; 3 -2.794,-1.905; 4 2.794,-1.905
SMT-JUMPER_3_1-NC_TRACE_SILK = smd 0.66 x 1.27: 1 -1.041,0; 2 0,0; 3 1.041,0
SOT23-5 = smd 0.55 x 1.2: 1 -0.95,-1.3; 2 0,-1.3; 3 0.95,-1.3; 4 0.95,1.3; 5 -0.95,1.3
DFN-8 = smd 0.3 x 0.7: 1 -0.75,-0.99; 2 -0.25,-0.99; 3 0.25,-0.99; 4 0.75,-0.99; 5 0.75,0.99; 6 0.25,0.99; 7 -0.25,0.99; 8 -0.75,0.99 | smd 1.38 x 0.8: 9 0,0
UDFN-8 = smd 0.3 x 0.65: 1 -0.975,-1.375; 2 -0.325,-1.375; 3 0.325,-1.375; 4 0.975,-1.375; 5 0.975,1.375; 6 0.325,1.375; 7 -0.325,1.375; 8 -0.975,1.375 | smd 2.35 x 1.6: EP 0,0

### Placement (x,y rotation side)
3V3_LED  38.1,13.97 0 bottom
BYP1  7.11,20.32 270 top
C1  65.28,19.05 180 bottom
C2  83.82,15.24 90 bottom
C3  30.48,15.24 270 top
C4  72.14,1.52 180 bottom
C5  26.67,10.16 270 bottom
C6  12.45,19.81 180 bottom
C7  12.45,21.59 180 bottom
C8  33.53,15.24 90 top
C9  72.14,3.3 180 bottom
C10  32,15.24 90 top
C11  24.38,15.24 270 top
C12  11.43,15.24 0 bottom
C13  10.16,8.89 180 top
C14  7.62,3.81 90 bottom
C15  22.86,15.24 270 top
C16  27.18,10.16 270 top
CURR_MEAS  14.99,10.41 180 top
D1  29.21,10.16 270 bottom
D2  25.65,10.16 270 top
D3  10.41,20.57 270 top
D4  12.19,20.57 270 top
D5  38.1,15.24 0 top
D6  43.18,15.24 0 top
F1  7.62,20.57 180 bottom
FD1  1.27,17.78 0 top
FD2  1.27,17.78 0 bottom
FD3  90.17,5.08 270 bottom
FD4  90.17,5.08 0 top
FRAME1  23.11,23.88 0 top
H1  2.54,20.32 0 top
H2  55.88,20.32 0 top
H3  55.88,2.54 0 top
H4  2.54,2.54 0 top
H5  85.98,7.49 0 top
J1  66.04,11.43 270 top
J2  52.07,1.27 180 top
J3  52.07,21.59 180 top
J4  68.45,5.08 0 bottom
J5  6.35,11.43 270 top
J6  17.78,19.05 0 top
J7  8.89,5.08 0 top
J8  78.74,2.54 0 bottom
JP1  38.1,10.16 180 bottom
LOGO1  88.9,20.32 0 bottom
LOGO2  8.89,6.86 0 top
LOGO3  8.89,1.02 0 bottom
R1  2.54,10.16 180 bottom
R2  2.54,12.7 180 bottom
R3  29.21,10.16 90 top
R4  44.45,10.16 270 top
R5  28.96,15.24 270 top
R6  22.86,10.16 270 bottom
R7  24.13,10.16 270 top
R8  39.37,10.16 90 top
R9  36.83,10.16 90 top
R10  25.91,15.24 90 top
R11  27.43,15.24 270 top
R12  40.64,15.24 90 bottom
R13  43.18,15.24 0 bottom
S1  50.8,13.97 0 top
S2  50.8,8.38 0 top
SCL/G7  50.8,12.7 0 bottom
U27  21.59,10.16 180 top
U34  41.91,10.16 0 top
U44  11.43,13.97 180 top
U64  33.02,10.16 0 top
U$1  57.15,11.43 90 top
U$2  60.96,12.7 0 bottom
U$3  [##BT##11]  52.07,1.65 90 top
U$4  [#TX#9]  49.53,1.65 90 top
U$5  [#RX#8]  46.99,1.65 90 top
U$6  [#CIPO#7]  44.45,1.65 90 top
U$7  [#COPI#6]  41.91,1.65 90 top
U$8  [#SCK#5]  39.37,1.65 90 top
U$9  [#D1#5]  36.83,1.65 90 top
U$10  [#D0#5]  34.29,1.65 90 top
U$11  [#PWM0#5]  29.21,1.65 90 top
U$12  [#PWM1#5]  31.75,1.65 90 top
U$13  [#A1#5]  26.67,1.65 90 top
U$14  [#A0#5]  24.13,1.65 90 top
U$15  [#GND#4]  21.59,1.65 90 top
U$16  [#3#3V#1]  16.51,1.65 90 top
U$17  [##RST##0]  13.97,1.65 90 top
U$18  [#MEAS#25]  14.99,8.64 0 top
U$19  [CHG20]  25.65,7.75 0 top
U$20  [RESET19]  46.48,10.92 90 top
U$21  [BOOT18]  46.48,5.59 90 top
U$22  [#VBT#16]  24.13,21.21 90 top
U$23  [#EN#15]  26.67,21.21 90 top
U$24  [#G0#14]  31.75,21.21 90 top
U$25  [#G1#14]  34.29,21.21 90 top
U$26  [#G2#14]  36.83,21.21 90 top
U$27  [#G3#14]  39.37,21.21 90 top
U$28  [#G4#14]  41.91,21.21 90 top
U$29  [#G5#14]  44.45,21.21 90 top
U$30  [#G6#14]  46.99,21.21 90 top
U$31  [#SCL#13]  49.53,21.21 90 top
U$32  [#SDA#12]  52.07,21.21 90 top
U$33  [3#3V22]  38.35,13.97 0 top
U$34  [VIN21]  43.18,13.97 0 top
U$35  [#VUB#15]  29.21,21.21 90 top
U$36  [THINGPLUS29]  87.63,17.53 90 top
U$37  [MICROMOD30]  89.92,17.53 90 top
U$38  [#31]  20.07,15.24 0 top
U$39  [#33]  15.75,15.24 0 top
U$40  [#BYP#27]  7.11,18.29 0 top
U$41  [#VE#16]  22.35,7.11 0 bottom
U$42  [#TX#9]  49.53,1.65 90 bottom
U$43  [#RX#8]  46.99,1.65 90 bottom
U$44  [#CIPO#7]  44.45,1.65 90 bottom
U$45  [#COPI#6]  41.91,1.65 90 bottom
U$46  [#SCK#5]  39.37,1.65 90 bottom
U$47  [#D1#5]  36.83,1.65 90 bottom
U$48  [#D0#5]  34.29,1.65 90 bottom
U$49  [#PWM0#5]  29.21,1.65 90 bottom
U$50  [#PWM1#5]  31.75,1.65 90 bottom
U$51  [#A1#5]  26.67,1.65 90 bottom
U$52  [#A0#5]  24.13,1.65 90 bottom
U$53  [#GND#4]  21.59,1.65 90 bottom
U$54  [#3#3V#1]  16.51,1.65 90 bottom
U$55  [##RST##0]  13.97,1.65 90 bottom
U$56  [##BOOT##10]  52.07,1.65 90 bottom
U$57  [#VBT#16]  24.13,21.21 90 bottom
U$58  [#EN#15]  26.67,21.21 90 bottom
U$59  [#G0#14]  31.75,21.21 90 bottom
U$60  [#G1#14]  34.29,21.21 90 bottom
U$61  [#G2#14]  36.83,21.21 90 bottom
U$62  [#G3#14]  39.37,21.21 90 bottom
U$63  [#G4#14]  41.91,21.21 90 bottom
U$64  [#G5#14]  44.45,21.21 90 bottom
U$65  [#G6#14]  46.99,21.21 90 bottom
U$66  [#MEAS#25]  14.99,12.19 0 bottom
U$67  [#SDA#12]  52.07,21.21 90 bottom
U$68  [#VUB#15]  29.21,21.21 90 bottom
U$69  [#3#3V_LED#25]  37.21,13.97 0 bottom
U$70  [#VIN_LED#25]  37.21,16.51 0 bottom
U$71  [#SCL#G7#14]  49.53,21.21 90 bottom
U$72  [#I2C#27]  39.5,10.16 0 bottom
U$73  [THINGPLUS_MICROMOD29]  57.15,9.4 0 bottom
U$74  [#SCL#G7#27]  49.4,12.7 0 bottom
VE  21.59,7.11 0 bottom
VIN_LED  38.1,16.51 0 bottom

### Tracks (layer width: path | path; a pad name or v marks a point on that pad's centre or on a via)
3.3V  (via drill 0.3)
  Top 0.178: v44.45,8.13 R4.2
  Top 0.305: J1.2 68.94,2.43 v69.85,1.52 | J1.74 69.2,20.43 v69.6,20.83 | R5.2 v28.96,13.21 | C8.1 34.38,14.39 34.54,14.22 v34.54,13.21 | U64.1 30.84,8.79 v30.73,8.89
  Top 0.508: C8.1 C10.1
  Bottom 0.305: 3V3_LED.2 37.58,12.46 38.1,11.94 JP1.2 38.1,8.89 | 38.1,8.89 43.69,8.89 v44.45,8.13 | J4.VCC 74.09,17.45 v74.17,17.53 | C1.2 67.31,19.05 67.56,19.3 67.56,20.57 67.82,20.83 v69.6,20.83 | 38.1,8.89 v30.73,8.89
  Bottom 0.508: C2.2 v83.82,17.27 | C4.1 71.12,1.52 | 71.12,1.52 v69.85,1.52 | 71.12,1.52 71.29,1.69 C9.1
  pour Route15 (isolate 0.305, rank 4): 0,22.86 0,0 91.44,0 91.44,22.86
3.3V_EN_VE  (via drill 0.3)
  Top 0.178: 29.21,7.11 20.45,7.11 v19.94,6.6 | R3.1 29.21,7.11 | 29.21,7.11 35.05,7.11 35.56,7.62 v35.56,11.94 34.8,11.94 34.4,11.54 U64.5
  Bottom 0.178: v19.94,6.6 20.45,7.11 VE.2
  Bottom 0.203: D1.C 34.93,11.31 v35.56,11.94
!BOOT!
  Top 0.178: S2.3 S2.4 53.59,5.08 53.99,4.68 58.17,4.68 | 58.17,4.68 J1.11 | J2.1 53.09,1.27 53.86,0.49 57.65,0.49 58.17,1.02 58.17,4.68
!I2C_INT!  (via drill 0.3)
  Top 0.178: U34.5 42.69,11.18 43.43,11.18 43.6,11.01 R4.1 45.63,11.01 47.24,9.4 v49.28,9.4 | J1.16 69.6,5.93 69.85,6.18 69.85,7.62 70.1,7.87 70.87,7.87 v71.88,6.86
  Bottom 0.178: v49.28,9.4 50.29,8.38 56.39,8.38 56.9,7.87 65.02,7.87 65.53,8.38 71.37,8.38 71.88,7.87 v71.88,6.86
!RST!  (via drill 0.3)
  Top 0.178: S1.3 S1.4 v53.59,13.97 | J1.6 70.99,3.43 71.25,3.17 73.66,3.17 | 73.66,3.17 J8.10 | v74.17,6.86 73.66,6.35 73.66,3.17
  Bottom 0.178: J2.16 13.97,4.06 14.48,4.57 30.99,4.57 32.77,6.35 44.96,6.35 46.48,7.87 46.48,10.41 47.5,11.43 53.09,11.43 53.59,11.94 53.59,13.21 | v74.17,6.86 74.17,12.45 73.41,13.21 53.59,13.21 | v53.59,13.97 53.59,13.21
!SD_CS!  (via drill 0.3)
  Top 0.178: J1.55 62.55,15.68 63.75,14.48 65.53,14.48 66.04,14.99 v66.04,16.26
  Route2 0.178: v66.04,16.26 75.69,16.26 76.2,16.76 v76.2,17.27
  Bottom 0.178: v76.2,17.27 76.29,17.18 J4.CS/DAT3
A0  (via drill 0.3)
  Top 0.178: J1.34 69.83,10.43 v70.1,10.16
  Route2 0.178: v32.51,4.06 33.53,5.08 50.29,5.08 50.71,5.5 v50.71,9.4
  Bottom 0.178: J2.12 24.13,3.3 24.89,4.06 v32.51,4.06 | v70.1,10.16 69.34,10.92 63.93,10.92 63.42,10.41 53.85,10.41 52.83,9.4 v50.71,9.4
A1  (via drill 0.3)
  Top 0.178: J1.38 66.8,11.43 66.55,11.18 66.55,10.41 66.29,10.16 v65.02,10.16
  Route2 0.178: v35.56,3.3 36.83,4.57 57.91,4.57 58.42,5.08 v58.42,9.4
  Bottom 0.178: J2.11 26.67,2.54 27.43,3.3 v35.56,3.3 | v65.02,10.16 64.26,9.4 v58.42,9.4
BATT_VIN/3  (via drill 0.3)
  Top 0.178: J1.49 57.96,14.18 v57.15,14.99 | v54.86,14.48 54.36,14.99 49.36,14.99 47.83,13.46 v46.99,13.46 | v25.91,13.08 R10.1
  Top 0.305: R10.1 R11.2
  Route15 0.178: v33.4,13.21 33.4,14.1 33.53,14.22 40.13,14.22 40.39,13.97 40.39,12.19 v40.34,12.15
  Bottom 0.178: v57.15,14.99 55.37,14.99 v54.86,14.48 | v46.99,13.46 45.21,13.46 44.36,12.61 41.57,12.61 41.11,12.15 v40.34,12.15 | v25.91,13.08 25.91,14.99 32.77,14.99 33.4,14.35 v33.4,13.21
CHG_LED
  Top 0.178: R7.1 24.13,12.19 23.88,12.45 22.86,12.45 22.54,12.13 U27.1
D0  (via drill 0.3)
  Top 0.178: v43.18,3.81 v50.29,3.81 | v66.29,3.56 66.29,3.81 66.91,4.43 J1.10 | J2.8 34.29,3.81 34.8,4.32 37.59,4.32 38.1,3.81 v38.1,3.3
  Bottom 0.178: v50.29,3.81 50.29,2.54 50.55,2.29 51.19,2.29 51.2,2.3 53.33,2.3 53.59,2.03 53.59,1.02 54.12,0.49 67.3,0.49 67.56,0.76 67.56,3.05 67.06,3.56 v66.29,3.56 | v38.1,3.3 42.67,3.3 v43.18,3.81
D1  (via drill 0.3)
  Top 0.178: v66.29,7.62 66.29,6.86 66.72,6.43 J1.18
  Bottom 0.178: J2.7 36.83,4.83 37.59,5.59 45.06,5.59 47.35,7.87 56.13,7.87 56.64,7.37 65.28,7.37 65.53,7.62 v66.29,7.62
EN  (via drill 0.3)
  Top 0.178: v64.52,2.79 66.8,2.79 66.94,2.93 J1.4 | v22.61,20.83 22.61,18.29 22.1,17.78 20.83,17.78 v20.07,17.02
  Route15 0.178: v64.52,2.79 64.52,4.32 63.75,5.08 59.94,5.08 57.15,7.87 54.86,7.87 53.59,6.6 26.16,6.6 v25.4,5.84
  Bottom 0.178: J3.11 26.67,20.57 26.42,20.32 23.11,20.32 v22.61,20.83 | v20.07,17.02 19.81,16.76 19.81,9.14 20.32,8.64 21.59,8.64 22,8.23 VE.1 24.13,7.11 v25.4,5.84
G0  (via drill 0.3)
  Top 0.178: J3.9 31.75,18.29 32.51,17.53 43.94,17.53 v44.45,17.02 | J1.40 v70.87,11.94
  Route15 0.178: v44.45,17.02 44.45,15.75 44.7,15.49 47.24,15.49 48.26,16.51 60.96,16.51 61.72,15.75 61.72,11.43 62.23,10.92 68.58,10.92 69.6,11.94 v70.87,11.94
G1  (via drill 0.3)
  Top 0.178: J3.8 34.29,19.56 34.8,19.05 v41.15,19.05 | J1.42 66.79,12.43 v66.04,11.68
  Route15 0.178: v46.74,16.26 47.5,17.02 61.21,17.02 62.48,15.75 62.48,12.19 62.99,11.68 v66.04,11.68
  Bottom 0.178: v41.15,19.05 45.97,19.05 46.74,18.29 v46.74,16.26
G2  (via drill 0.3)
  Top 0.178: J1.44 65.51,12.93 v65.02,12.45
  Route15 0.178: J3.7 36.83,18.54 37.59,17.78 61.47,17.78 63.25,16 63.25,12.95 63.75,12.45 v65.02,12.45
G3  (via drill 0.3)
  Top 0.178: J1.46 69.56,13.43 69.85,13.72 69.85,18.54 v70.36,19.05
  Route15 0.178: J3.6 39.37,19.3 40.39,18.29 61.98,18.29 62.23,18.03 69.34,18.03 v70.36,19.05
G4  (via drill 0.3)
  Top 0.178: J1.48 67.35,13.93 67.06,14.22 67.06,19.3 66.8,19.56 64.01,19.56 63.5,20.07 v63.5,21.59
  Route2 0.178: J3.5 41.91,19.81 43.43,18.29 57.4,18.29 57.91,18.8 57.91,21.08 58.93,22.1 62.99,22.1 v63.5,21.59
G5  (via drill 0.3)
  Top 0.178: J1.73 62.37,20.18 v62.74,19.81
  Route2 0.178: J3.4 44.45,20.07 44.96,19.56 51.31,19.56 v51.82,19.05
  Bottom 0.178: v51.82,19.05 53.85,17.02 61.47,17.02 61.72,17.27 61.72,19.56 61.98,19.81 v62.74,19.81
G6  (via drill 0.3)
  Top 0.178: J1.71 59.82,19.68 59.44,20.07 v59.44,20.02
  Route2 0.178: J3.3 46.99,20.32 47.24,20.07 v52.32,20.07
  Route15 0.178: v52.32,20.07 53.34,20.07 53.59,20.32 53.59,22.1 53.85,22.35 57.91,22.35 58.17,22.1 58.17,20.32 58.47,20.02 v59.44,20.02
G7  (via drill 0.3)
  Top 0.178: J1.69 62.35,19.18 v62.74,18.8
  Bottom 0.178: SCL/G7.1 51.84,16.03 52.32,16.51 57.41,16.51 57.42,16.5 62.47,16.5 62.74,16.76 v62.74,18.8
GND  (via drill 0.3)
  Top 0.178: D6.C 44.06,13.83 v43.94,13.72 | S1.1 S1.2 53.98,15.88 54.1,15.75 | 48.01,10.41 S2.1
  Top 0.305: J7.1 7.37,5.1 v7.37,6.6 | U64.4 33.99,9.44 33.78,9.65 | v34.8,10.16 U64.EP v31.24,10.16 | U34.6 42.16,10.41 U34.9 | U34.9 v43.18,10.16 43.18,9.4 42.95,9.17 U34.4 | U34.9 v40.64,10.16 40.64,9.4 40.87,9.17 U34.1 | J1.75 59.84,20.68 v59.44,21.08 | U27.2 v21.59,12.7 | 8.62,8.21 J5.GND2 | C8.2 C10.2 32,16.76 v31.5,17.27
  Top 0.508: C11.2 C15.2 v22.86,13.21 | v26.67,17.27 27.43,16.51 R11.1 | C3.2 v30.48,13.08
  Bottom 0.508: J4.CD1 66.44,5.48 v66.29,5.33 | v74.68,1.27 74.42,1.52 C4.2 C9.2
  other vias: 8.89,1.78 57.15,11.18 49.53,10.67 22.86,3.05 25.65,3.05 27.94,7.87 30.48,19.56 33.02,19.56 38.1,8.13 59.44,1.27 64.01,1.27 71.12,20.83 17.78,20.32 17.78,21.59 19.05,21.59 19.05,20.32 13.97,6.35 15.24,6.35 16.51,6.35 19.05,3.05 20.32,3.05 21.59,3.05 71.88,10.16 71.88,11.18 71.88,19.56 71.88,17.53 38.1,19.81 10.67,16.51 59.18,11.18 58.17,11.18 74.68,2.29 76.2,10.16 76.2,11.43 76.2,12.7 50.8,10.67 52.07,10.67 58.42,15.24 26.67,5.84 27.94,5.84 6.1,3.3 6.1,4.57 4.83,4.57 45.97,17.02 15.49,17.27 15.49,16.26 16.76,12.19 16.51,20.32 16.51,21.59 17.78,6.35
  pour Top (isolate 0.254): 0,22.86 91.44,22.86 91.44,0 0,0
  pour Bottom (isolate 0.254): 0,22.86 0,0 91.44,0 91.44,22.86
  pour Route2 (isolate 0.305): 0,22.86 91.44,22.86 91.44,0 0,0
N$2  (via drill 0.3)
  Top 0.178: R8.2 v39.37,12.19
  Bottom 0.178: JP1.3 39.14,11.2 39.37,11.43 v39.37,12.19
N$3  (via drill 0.3)
  Top 0.178: R9.2 v36.83,12.19
  Bottom 0.178: v36.83,12.19 36.83,11.43 37.08,11.18 37.08,10.19 JP1.1
N$4  (via drill 0.3)
  Top 0.457: D3.A v10.41,18.29 | BYP1.2 v7.11,18.29
  Bottom 0.457: v7.11,18.29 9.14,18.29 | 9.14,18.29 v10.41,18.29 | F1.2 9.14,20.55 9.14,18.29
N$5  (via drill 0.3)
  Top 0.178: CURR_MEAS.1 CURR_MEAS.3
  Top 0.457: D4.C D3.C 9.02,21.72 8.89,21.59 8.89,13.46 9.4,12.95 9.4,11.94 v10.16,11.18
  Bottom 0.457: v10.16,11.18 10.16,9.14 10.67,8.64 15.75,8.64 16.26,9.14 CURR_MEAS.3
N$6
  Bottom 0.178: 3V3_LED.1 39.12,13.97 39.37,14.22 39.37,15.75 39.71,16.09 R12.2
N$8  (via drill 0.3)
  Top 0.178: U27.5 21.87,8.86 21.84,8.89 v21.84,9.91
  Bottom 0.178: v21.84,9.91 21.84,9.4 21.93,9.31 R6.2
N$9  (via drill 0.3)
  Top 0.178: D5.A 37.22,14.09 37.59,13.72 v41.91,13.72
  Bottom 0.178: R12.1 41.74,14.39 41.91,14.22 v41.91,13.72
N$10
  Bottom 0.178: VIN_LED.1 38.62,17.29 38.86,17.53 41.91,17.53 42.33,17.11 R13.2
N$11  (via drill 0.3)
  Top 0.178: D6.A 42.3,16.14 42.93,16.76 v43.43,16.76
  Bottom 0.178: R13.1 44.03,16.17 v43.43,16.76
N$12  (via drill 0.3)
  Top 0.178: J5.A5 5.14,12.68 5.07,12.61 3.39,12.61 3.05,12.95 v3.05,14.22
  Bottom 0.178: v3.05,14.22 3.39,13.88 R2.2
N$13  (via drill 0.3)
  Top 0.178: v8.38,10.16 7.9,9.68 J5.B5
  Bottom 0.178: R1.2 3.39,6.26 3.9,5.75 8.04,5.75 8.38,6.1 v8.38,10.16
N$14
  Top 0.178: R7.2 25.63,9.31 D2.C
PWM0  (via drill 0.3)
  Top 0.178: v70.87,10.92 70.87,9.65 70.64,9.42 69.84,9.42 69.33,9.93 J1.32 | v54.1,9.14 53.7,8.74 46.84,8.74 44.71,6.6 29.72,6.6 29.21,6.1 J2.10
  Bottom 0.178: v70.87,10.92 70.87,9.23 70.53,8.89 65.28,8.89 64.77,8.38 57.15,8.38 56.64,8.89 54.36,8.89 v54.1,9.14
PWM1  (via drill 0.3)
  Top 0.178: J1.47 56.86,13.68 56.39,13.21 v56.39,9.65 | J2.9 31.75,5.08 v30.99,5.84
  Route2 0.178: v56.39,9.65 v56.39,6.35
  Route15 0.178: v30.99,5.84 55.88,5.84 v56.39,6.35
QWIIC_EN  (via drill 0.3)
  Top 0.178: U44.3 10.48,14.41 11.18,13.72 v15.75,13.72 | v58.93,19.05 59.3,18.68 J1.67 | v26.67,18.54 27.69,18.54 28.96,17.27 R5.1
  Route2 0.178: v35.56,19.81 35.56,18.29 36.07,17.78 58.67,17.78 58.93,18.03 v58.93,19.05
  Bottom 0.178: v15.75,13.72 14.73,14.73 14.73,17.78 15.49,18.54 v26.67,18.54 28.19,18.54 28.54,18.89 34.63,18.89 v35.56,19.81
QWIIC_PWR  (via drill 0.3)
  Top 0.178: v7.62,1.78 7.62,2.79 8.39,3.56 J7.2
  Top 0.305: J7.2 8.39,6.1 8.64,6.35 10.67,6.35 11.01,6.69 C13.1 11.01,10.25 12.38,11.62 U44.5
  Bottom 0.178: C14.1 v7.62,1.78
SCL  (via drill 0.3)
  Top 0.178: U34.7 41.66,11.94 41.91,12.19 44.7,12.19 45.82,13.31 45.82,14.58 45.97,14.73 v47.62,14.73 | J1.14 70.61,5.43 v70.61,6.86 | J7.4 10.39,3.83 10.67,3.56 v12.7,3.56 | v39.37,8.13 R8.1
  Route2 0.178: v47.62,14.73 49.4,12.95 63.75,12.95 64.26,12.45 64.26,7.37 64.77,6.86 v70.61,6.86
  Route15 0.178: v16,7.62 21.08,7.62 21.59,7.11 39.37,7.11 | v39.37,8.13 39.37,7.11 | 39.37,7.11 42.93,7.11 43.18,7.37 v43.18,7.87
  Bottom 0.178: SCL/G7.3 49.76,14.22 49.25,14.73 v47.62,14.73 47.62,12.57 45.72,10.67 45.72,8.13 44.7,7.11 43.69,7.11 43.18,7.62 v43.18,7.87 | v12.7,3.56 12.7,7.11 13.21,7.62 v16,7.62
SCL/G7
  Bottom 0.178: SCL/G7.2 50.8,17.27 49.53,18.54 J3.2
SDA  (via drill 0.3)
  Top 0.178: J3.1 52.07,20.83 49.53,18.29 45.21,18.29 | v72.64,22.1 72.9,21.84 v72.9,12.45 | 45.21,18.29 v33.27,18.29 | 45.21,18.29 45.21,13.46 44.45,12.7 41.15,12.7 | v36.83,8.13 R9.1 37.76,9.31 38.1,9.65 38.1,12.45 38.61,12.95 40.89,12.95 41.15,12.7 | J1.12 72.49,4.93 72.9,5.33 v72.9,6.86 | U34.8 41.15,11.16 41.15,12.7 | J7.3 9.39,3.31 10.16,2.54 v10.16,1.78
  Route2 0.178: J3.1 52.07,22.34 52.32,22.59 72.15,22.59 v72.64,22.1
  Bottom 0.178: v33.27,18.29 28.96,18.29 28.45,17.78 28.45,16.51 27.94,16 25.65,16 25.15,16.51 25.15,17.53 24.64,18.03 17.27,18.03 16.76,17.53 16.76,13.46 16.26,12.95 9.91,12.95 9.4,12.45 9.4,3.3 10.16,2.54 v10.16,1.78 | v72.9,12.45 v72.9,6.86
SPI_CIPO  (via drill 0.3)
  Top 0.178: J1.61 64.93,17.18 v65.02,17.27 | v53.59,3.05 45.47,3.05 44.45,2.03 J2.4
  Bottom 0.178: v53.59,3.05 53.59,4.06 54.12,4.58 57.14,4.58 58.17,3.56 65.02,3.56 65.79,4.32 77.98,4.32 78.23,4.57 78.23,18.03 77.72,18.54 71.12,18.54 70.87,18.29 70.87,17.27 | 70.87,17.27 70.87,15.85 J4.DO/DAT0 | v65.02,17.27 70.87,17.27
SPI_COPI  (via drill 0.3)
  Top 0.178: J1.59 63.33,16.68 63.75,16.26 v64.26,16.26 | J2.5 41.91,4.06 42.42,4.57 51.14,4.57 51.56,4.15 v51.56,3.9
  Route15 0.178: v65.02,5.08 65.53,4.57 73.91,4.57 v74.42,5.08
  Bottom 0.178: v64.26,16.26 64.26,14.48 64.77,13.97 74.93,13.97 | J4.DI/CMD 75.19,14.23 74.93,13.97 | v51.56,3.9 51.56,4.83 51.82,5.08 v65.02,5.08 | 74.93,13.97 74.93,5.59 v74.42,5.08
SPI_SCK  (via drill 0.3)
  Top 0.178: v65.02,15.24 64.01,15.24 63.07,16.18 J1.57 56.06,16.18 55.63,15.75 55.63,9.14 54.61,8.13 46.99,8.13 46.48,7.62 46.48,5.59 45.97,5.08 39.88,5.08 39.37,4.57 J2.6
  Bottom 0.178: v65.02,15.24 65.79,14.48 72.64,14.48 72.99,14.83 J4.SCLK
SWDCK  (via drill 0.3)
  Top 0.178: J1.21 63.94,7.18 v65.02,6.1
  Route2 0.178: v65.02,6.1 79.5,6.1 80.01,5.59 J8.4
SWDIO
  Top 0.178: J1.23 63.31,7.68 64.26,8.64 80.52,8.64 81.28,7.87 J8.2
UART_RX  (via drill 0.3)
  Top 0.178: J1.19 57.58,6.68 57.15,7.11 v55.37,7.11
  Bottom 0.178: J2.3 46.99,6.35 47.75,7.11 v55.37,7.11
UART_TX  (via drill 0.3)
  Top 0.178: J1.17 58,6.18 v57.66,5.84
  Bottom 0.178: J2.2 49.53,5.08 50.04,5.59 57.4,5.59 v57.66,5.84
USB_D+  (via drill 0.3)
  Top 0.178: J1.3 63.13,2.68 63.75,3.3 v63.75,6.1 | J5.A6 5.33,11.68 5.08,11.43 5.08,10.92 5.33,10.67 6,10.67 J5.B6 7.37,10.68 7.87,11.18 v8.38,11.18
  Route2 0.178: 7.62,11.43 7.62,14.48 8.13,14.99
  Route2 0.203: v63.75,6.1 63.75,11.94 63.25,12.45 46.48,12.45 46.23,12.7 46.23,14.48 45.72,14.99 8.13,14.99 | 7.62,11.43 7.87,11.18 v8.38,11.18
USB_D-  (via drill 0.3)
  Top 0.178: J1.5 62.62,3.18 63.25,3.81 63.25,5.33 v62.74,5.84 | J5.B7 6.02,12.19 6.86,12.19 6.87,12.19 7.11,12.19 | v8.38,12.19 7.11,12.19 | J5.A7 6.86,11.18 7.11,11.43 7.11,12.19
  Route2 0.178: v62.74,5.84 62.99,6.1 62.99,11.18 62.74,11.43
  Route2 0.203: 62.74,11.43 62.23,11.94 45.72,11.94 45.47,12.19 45.47,13.97 44.96,14.48 8.64,14.48 8.38,14.22 v8.38,12.19
V_BATT  (via drill 0.3)
  Top 0.305: U34.2 U34.3 42.16,8.12 v41.91,7.87 41.66,8.12 U34.2
  Top 0.457: U27.3 19.53,11.46 18.78,12.21 J6.2 18.8,15.37 18.8,18.54 18.29,19.05 16.76,19.05 15.75,18.03 12.45,18.03 12.19,18.29 D4.A
  Top 0.508: J3.12 v24.13,17.27 24.38,17.02 C11.1 | C11.1 C15.1 20.92,16.09 20.18,15.35 J6.2 | C11.1 R10.2
  Bottom 0.508: v24.13,17.27 24.13,8.13 25.15,7.11 41.15,7.11 v41.91,7.87
V_USB  (via drill 0.3)
  Top 0.254: J1.9 62.09,4.18 v62.23,4.32
  Top 0.406: J5.VBUS1 5.5,13.88 v4.83,13.21 | J5.VBUS2 5.5,8.98 v4.83,9.65
  Top 0.457: BYP1.1 7.11,21.84 v7.37,22.1
  Top 0.508: J3.10 29.21,19.05 30.48,17.78 C3.1
  Route15 0.356: v62.23,4.32 59.18,4.32 58.42,5.08 9.65,5.08 8.89,5.84 8.89,7.62 6.86,9.65 v4.83,9.65
  Bottom 0.457: v7.37,22.1 7.37,20.83 7.11,20.57 F1.1 6.12,17.25 7.62,15.75 7.62,13.21
  Bottom 0.508: v4.83,9.65 v4.83,13.21 7.62,13.21 8.64,13.21 9.4,13.97 13.46,13.97 13.97,14.48 13.97,18.29 15.24,19.56 28.7,19.56 29.21,20.07 J3.10
  pour Route15 (isolate 0.305, rank 3): 7.62,16.51 7.62,8.89 3.81,8.89 3.81,16.51
VIN  (via drill 0.3)
  Top 0.178: CURR_MEAS.4 CURR_MEAS.2
  Top 0.305: v32,12.45 32.05,12.4 U64.8 30.84,11.54 30.31,11.01 R3.2 | v27.18,12.19 C16.1
  Top 0.457: C16.1 R3.2
  Top 0.508: U44.1 12.38,16.19 v12.95,16.76 | D2.A 25.68,11.01 C16.1 | v20.57,10.16 20.64,10.09 U27.4
  Route15 0.305: v20.57,10.16 20.57,10.92 20.83,11.18 26.92,11.18 27.18,11.43 v27.18,12.19
  Route15 0.508: v42.93,13.46 42.93,14.73 42.42,15.24 32,15.24 | v32,12.45 32,15.24 | v12.95,16.76 14.48,15.24 32,15.24
  Bottom 0.178: v32,12.45 35.05,12.45 35.56,12.95 35.56,16 36.07,16.51 VIN_LED.2
  Bottom 0.305: C5.1 27.18,11.57 v27.18,12.19
  Bottom 0.508: C7.1 C6.1 11.6,18.38 11.68,18.29 12.7,18.29 12.95,18.03 v12.95,16.76 12.28,16.09 C12.1
  pour Route15 (isolate 0.305, rank 2): 3.81,19.05 11.43,19.05 11.43,9.4 14.99,9.4 14.99,22.61 3.81,22.61

### Text on the board
Bottom: v01
tDocu: Ricardo R.